# Altium schematic sheet Power_Supply.SchDoc: Power_Supply
size A3; Date: 18/06/2014; DrawnBy: J. Gabriel R.E.; Organization: Seven Solutions S.L.; Address1: C/Baza, Parcela 19, Nave 3; Address2: Polнgono Ind. Juncaril; Address3: 18210-Peligros-Granada; Address4: Spain; Revision: 3.4; SheetNumber: 2; SheetTotal: 23; WebAddress: www.sevensols.com; Project: White Rabbit; ProjectName: Project Name
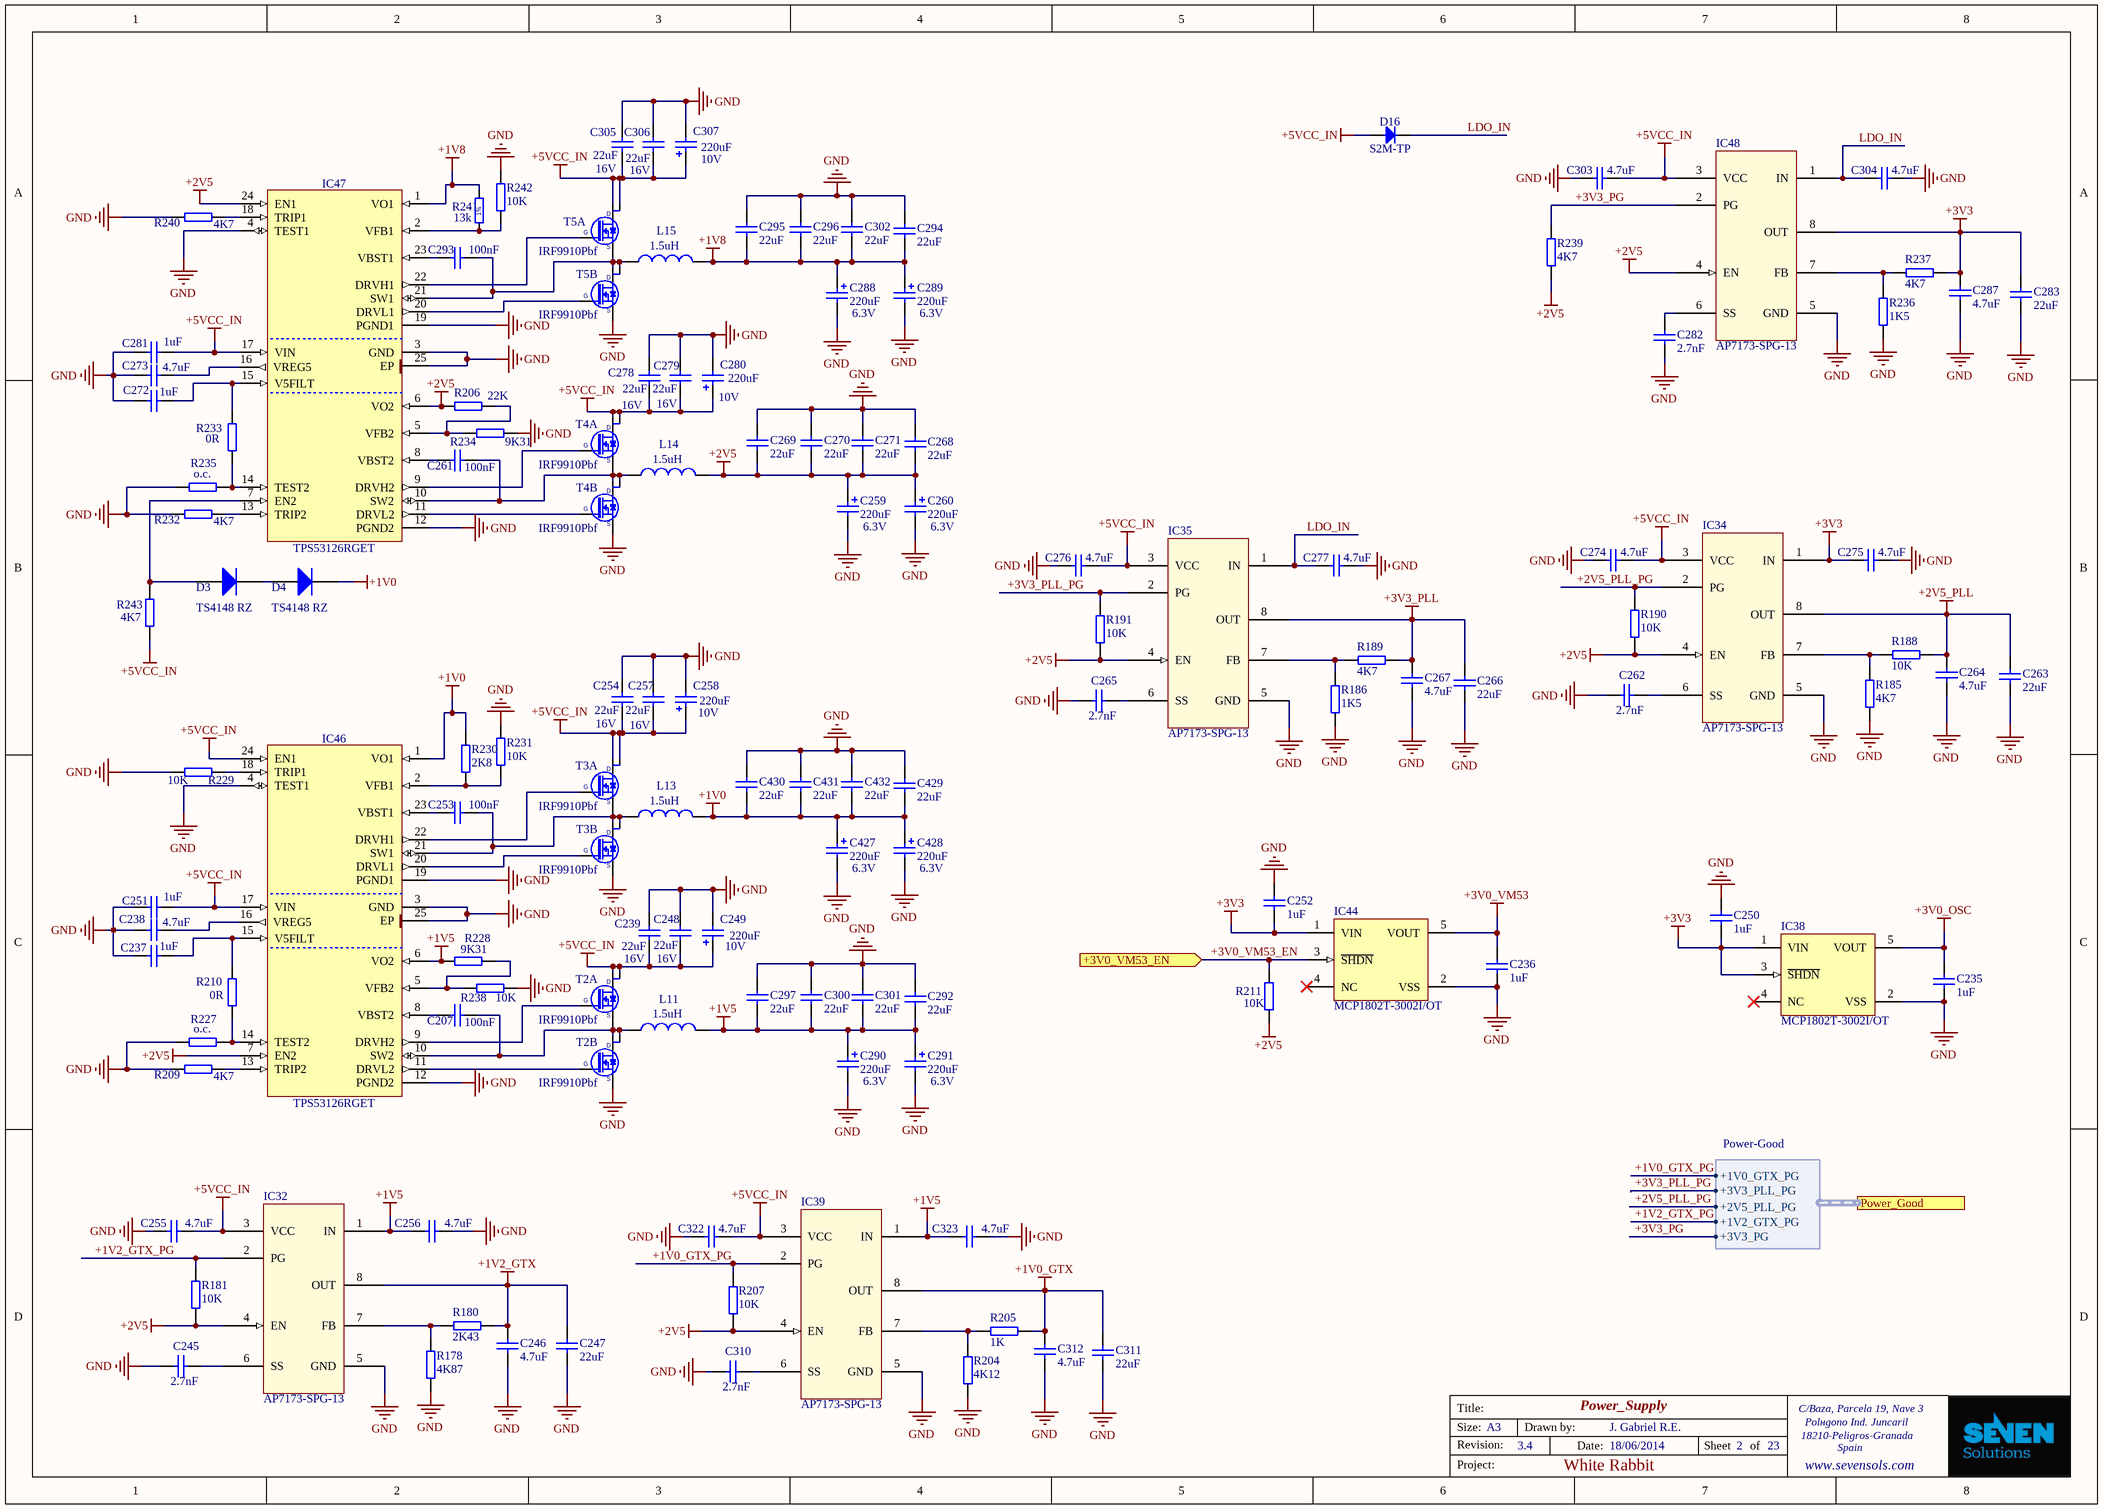
[diagram p0: Power_Supply.SchDoc]

## Parts
C207  100nF  [CC1005-0402]
C235  1uF  [CC1005-0402]
C236  1uF  [CC1005-0402]
C237  1uF  [CC1005-0402]
C238  4.7uF  [CC1608-0603]
C239  value 22uF  Voltage: 16V  [CC2012-0805]  (hidden comment: 22uF 16V)
C245  2.7nF  [CC1005-0402]
C246  4.7uF  [CC1608-0603]
C247  22uF  [CC2012-0805]
C248  value 22uF  Voltage: 16V  [CC2012-0805]  (hidden comment: 22uF 16V)
C249  value 220uF  Voltage: 10V  [D]  (hidden comment: 220uF 10V)
C250  1uF  [CC1005-0402]
C251  1uF  [CC1005-0402]
C252  1uF  [CC1005-0402]
C253  100nF  [CC1005-0402]
C254  value 22uF  Voltage: 16V  [CC2012-0805]  (hidden comment: 22uF 16V)
C255  4.7uF  [CC1608-0603]
C256  4.7uF  [CC1608-0603]
C257  value 22uF  Voltage: 16V  [CC2012-0805]  (hidden comment: 22uF 16V)
C258  value 220uF  Voltage: 10V  [D]  (hidden comment: 220uF 10V)
C259  Voltage: 6.3V  [D]  (hidden comment: 220uF)
C260  Voltage: 6.3V  [D]  (hidden comment: 220uF)
C261  100nF  [CC1005-0402]
C262  2.7nF  [CC1005-0402]
C263  22uF  [CC2012-0805]
C264  4.7uF  [CC1608-0603]
C265  2.7nF  [CC1005-0402]
C266  22uF  [CC2012-0805]
C267  4.7uF  [CC1608-0603]
C268  22uF  [CC2012-0805]
C269  22uF  [CC2012-0805]
C270  22uF  [CC2012-0805]
C271  22uF  [CC2012-0805]
C272  1uF  [CC1005-0402]
C273  4.7uF  [CC1608-0603]
C274  4.7uF  [CC1608-0603]
C275  4.7uF  [CC1608-0603]
C276  4.7uF  [CC1608-0603]
C277  4.7uF  [CC1608-0603]
C278  value 22uF  Voltage: 16V  [CC2012-0805]  (hidden comment: 22uF 16V)
C279  value 22uF  Voltage: 16V  [CC2012-0805]  (hidden comment: 22uF 16V)
C280  value 220uF  Voltage: 10V  [D]  (hidden comment: 220uF 10V)
C281  1uF  [CC1005-0402]
C282  2.7nF  [CC1005-0402]
C283  22uF  [CC2012-0805]
C287  4.7uF  [CC1608-0603]
C288  Voltage: 6.3V  [D]  (hidden comment: 220uF)
C289  Voltage: 6.3V  [D]  (hidden comment: 220uF)
C290  Voltage: 6.3V  [D]  (hidden comment: 220uF)
C291  Voltage: 6.3V  [D]  (hidden comment: 220uF)
C292  22uF  [CC2012-0805]
C293  100nF  [CC1005-0402]
C294  22uF  [CC2012-0805]
C295  22uF  [CC2012-0805]
C296  22uF  [CC2012-0805]
C297  22uF  [CC2012-0805]
C300  22uF  [CC2012-0805]
C301  22uF  [CC2012-0805]
C302  22uF  [CC2012-0805]
C303  4.7uF  [CC1608-0603]
C304  4.7uF  [CC1608-0603]
C305  value 22uF  Voltage: 16V  [CC2012-0805]  (hidden comment: 22uF 16V)
C306  value 22uF  Voltage: 16V  [CC2012-0805]  (hidden comment: 22uF 16V)
C307  value 220uF  Voltage: 10V  [D]  (hidden comment: 220uF 10V)
C310  2.7nF  [CC1005-0402]
C311  22uF  [CC2012-0805]
C312  4.7uF  [CC1608-0603]
C322  4.7uF  [CC1608-0603]
C323  4.7uF  [CC1608-0603]
C427  Voltage: 6.3V  [D]  (hidden comment: 220uF)
C428  Voltage: 6.3V  [D]  (hidden comment: 220uF)
C429  22uF  [CC2012-0805]
C430  22uF  [CC2012-0805]
C431  22uF  [CC2012-0805]
C432  22uF  [CC2012-0805]
D3  TS4148 RZ  [CD1608-0603]
D4  TS4148 RZ  [CD1608-0603]
D16  S2M-TP  [DO-214AA/SMB-MCC]
IC32  AP7173-SPG-13  [SOIC127P600-8AL-ThermalPad]
IC34  AP7173-SPG-13  [SOIC127P600-8AL-ThermalPad]
IC35  AP7173-SPG-13  [SOIC127P600-8AL-ThermalPad]
IC38  MCP1802T-3002I/OT  [SOT-23-OT5_N]
IC39  AP7173-SPG-13  [SOIC127P600-8AL-ThermalPad]
IC44  MCP1802T-3002I/OT  [SOT-23-OT5_N]
IC46  TPS53126RGET  [QFN50P400X400X100-25N-S255]
IC47  TPS53126RGET  [QFN50P400X400X100-25N-S255]
IC48  AP7173-SPG-13  [SOIC127P600-8AL-ThermalPad]
L11  value 1.5uH  [IHLP2525]  (hidden comment: IHLP2525CZER1R5M01)
L13  value 1.5uH  [IHLP2525]  (hidden comment: IHLP2525CZER1R5M01)
L14  value 1.5uH  [IHLP2525]  (hidden comment: IHLP2525CZER1R5M01)
L15  value 1.5uH  [IHLP2525]  (hidden comment: IHLP2525CZER1R5M01)
R178  4K87  [0402]
R180  2K43  [0402]
R181  10k  [0402]
R185  4K7  [0402]
R186  1K5  [0402]
R188  10K  [0402]
R189  4K7  [0402]
R190  10k  [0402]
R191  10k  [0402]
R204  4K12  [0402]
R205  1K  [0402]
R206  22K  [0402]
R207  10K  [0402]
R209  4K7  [0402]
R210  value 0R  [0402]  (hidden comment: Jumper)
R211  10k  [0402]
R227  o.c.  [0402]
R228  9K31  [0402]
R229  10K  [0402]
R230  2K8  [0402]
R231  10K  [0402]
R232  4K7  [0402]
R233  value 0R  [0402]  (hidden comment: Jumper)
R234  9K31  [0402]
R235  o.c.  [0402]
R236  1K5  [0402]
R237  4K7  [0402]
R238  10K  [0402]
R239  4K7  [0402]
R240  4K7  [0402]
R241  13k  [RESC1005X40N]
R242  10K  [0402]
R243  4K7  [0402]
T2  IRF9910Pbf  [SOIC127P600X175-8N]  (parts A,B of 2)
T3  IRF9910Pbf  [SOIC127P600X175-8N]  (parts A,B of 2)
T4  IRF9910Pbf  [SOIC127P600X175-8N]  (parts A,B of 2)
T5  IRF9910Pbf  [SOIC127P600X175-8N]  (parts A,B of 2)

## Ports
+3V0_VM53_EN (in), Power_Good (harness Power-Good)

## Harnesses
Power-Good: +1V2_GTX_PG, +2V5_PLL_PG, +3V3_PLL_PG, +1V0_GTX_PG, +3V3_PG

## Nets
+1V0: C427.1 C428.1 C429.1 C430.2 C431.1 C432.1 D4.2(K) IC46.1(VO1) L13.2 R230.2
+1V0_GTX: C311.2 C312.2 IC39.8(OUT) R205.2
+1V2_GTX: C246.2 C247.2 IC32.8(OUT) R180.2
+1V5: C256.1 C290.1 C291.1 C292.1 C297.2 C300.1 C301.1 C323.1 IC32.1(IN) IC39.1(IN) IC46.6(VO2) L11.2 R228.1
+1V8: C288.1 C289.1 C294.1 C295.2 C296.1 C302.1 IC47.1(VO1) L15.2 R241.2
+2V5: C259.1 C260.1 C268.1 C269.2 C270.1 C271.1 IC32.4(EN) IC34.4(EN) IC35.4(EN) IC39.4(EN) IC46.7(EN2) IC47.6(VO2) IC47.24(EN1) IC48.4(EN) L14.2 R181.1 R190.1 R191.1 R206.2 R207.1 R211.2 R239.1
+2V5_PLL: C263.2 C264.2 IC34.8(OUT) R188.1
+3V0_OSC: C235.2 IC38.5(VOUT)
+3V0_VM53: C236.2 IC44.5(VOUT)
+3V3: C250.2 C252.2 C275.1 C283.2 C287.2 IC34.1(IN) IC38.1(VIN) IC38.3(~{SHDN}) IC44.1(VIN) IC48.8(OUT) R237.2
+3V3_PLL: C266.2 C267.2 IC35.8(OUT) R189.1
+5VCC_IN: C239.1 C248.1 C249.1 C251.2 C254.1 C255.2 C257.1 C258.1 C274.2 C276.2 C278.1 C279.1 C280.1 C281.2 C303.2 C305.1 C306.1 C307.1 C322.2 D16.2(A) IC32.3(VCC) IC34.3(VCC) IC35.3(VCC) IC39.3(VCC) IC46.17(VIN) IC46.24(EN1) IC47.17(VIN) IC48.3(VCC) R243.2 T2.5(D) T2.6(D) T3.5(D) T3.6(D) T4.5(D) T4.6(D) T5.5(D) T5.6(D)
GND: C235.1 C236.1 C237.1 C238.2 C239.2 C245.1 C246.1 C247.1 C248.2 C249.2 C250.1 C251.1 C252.1 C254.2 C255.1 C256.2 C257.2 C258.2 C259.2 C260.2 C262.1 C263.1 C264.1 C265.1 C266.1 C267.1 C268.2 C269.1 C270.2 C271.2 C272.1 C273.2 C274.1 C275.2 C276.1 C277.2 C278.2 C279.2 C280.2 C281.1 C282.1 C283.1 C287.1 C288.2 C289.2 C290.2 C291.2 C292.2 C294.2 C295.1 C296.2 C297.1 C300.2 C301.2 C302.2 C303.1 C304.2 C305.2 C306.2 C307.2 C310.1 C311.1 C312.1 C322.1 C323.2 C427.2 C428.2 C429.2 C430.1 C431.2 C432.2 IC32.5(GND) IC34.5(GND) IC35.5(GND) IC38.2(VSS) IC39.5(GND) IC44.2(VSS) IC46.3(GND) IC46.4(TEST1) IC46.12(PGND2) IC46.19(PGND1) IC46.25(EP) IC47.3(GND) IC47.4(TEST1) IC47.12(PGND2) IC47.19(PGND1) IC47.25(EP) IC48.5(GND) R178.1 R185.1 R186.1 R204.1 R209.2 R227.1 R229.2 R231.2 R232.2 R234.2 R235.1 R236.1 R238.2 R240.2 R242.2 T2.1(S) T3.1(S) T4.1(S) T5.1(S)
+1V0_GTX_PG: IC39.2(PG) R207.2 ; port Power_Good.+1V0_GTX_PG
+1V2_GTX_PG: IC32.2(PG) R181.2 ; port Power_Good.+1V2_GTX_PG
+2V5_PLL_PG: IC34.2(PG) R190.2 ; port Power_Good.+2V5_PLL_PG
+3V0_VM53_EN: IC44.3(~{SHDN}) R211.1 ; port +3V0_VM53_EN
+3V3_PG: IC48.2(PG) R239.2 ; port Power_Good.+3V3_PG
+3V3_PLL_PG: IC35.2(PG) R191.2 ; port Power_Good.+3V3_PLL_PG
LDO_IN: C277.1 C304.1 D16.1(C) IC35.1(IN) IC48.1(IN)
NetC207_1: C207.1 IC46.8(VBST2)
NetC207_2: C207.2 IC46.10(SW2) L11.1 T2.3(S) T2.7(D) T2.8(D)
NetC237_2: C237.2 IC46.15(V5FILT) R210.1
NetC238_1: C238.1 IC46.16(VREG5)
NetC245_2: C245.2 IC32.6(SS)
NetC253_1: C253.1 IC46.23(VBST1)
NetC253_2: C253.2 IC46.21(SW1) L13.1 T3.3(S) T3.7(D) T3.8(D)
NetC261_1: C261.1 IC47.8(VBST2)
NetC261_2: C261.2 IC47.10(SW2) L14.1 T4.3(S) T4.7(D) T4.8(D)
NetC262_2: C262.2 IC34.6(SS)
NetC265_2: C265.2 IC35.6(SS)
NetC272_2: C272.2 IC47.15(V5FILT) R233.1
NetC273_1: C273.1 IC47.16(VREG5)
NetC282_2: C282.2 IC48.6(SS)
NetC293_1: C293.1 IC47.23(VBST1)
NetC293_2: C293.2 IC47.21(SW1) L15.1 T5.3(S) T5.7(D) T5.8(D)
NetC310_2: C310.2 IC39.6(SS)
NetD3_1: D3.1(A) IC47.7(EN2) R243.1
NetD3_2: D3.2(K) D4.1(A)
NetIC32_7: IC32.7(FB) R178.2 R180.1
NetIC34_7: IC34.7(FB) R185.2 R188.2
NetIC35_7: IC35.7(FB) R186.2 R189.2
NetIC39_7: IC39.7(FB) R204.2 R205.1
NetIC46_2: IC46.2(VFB1) R230.1 R231.1
NetIC46_5: IC46.5(VFB2) R228.2 R238.1
NetIC46_9: IC46.9(DRVH2) T2.4(G)
NetIC46_11: IC46.11(DRVL2) T2.2(G)
NetIC46_13: IC46.13(TRIP2) R209.1
NetIC46_14: IC46.14(TEST2) R210.2 R227.2
NetIC46_18: IC46.18(TRIP1) R229.1
NetIC46_20: IC46.20(DRVL1) T3.2(G)
NetIC46_22: IC46.22(DRVH1) T3.4(G)
NetIC47_2: IC47.2(VFB1) R241.1 R242.1
NetIC47_5: IC47.5(VFB2) R206.1 R234.1
NetIC47_9: IC47.9(DRVH2) T4.4(G)
NetIC47_11: IC47.11(DRVL2) T4.2(G)
NetIC47_13: IC47.13(TRIP2) R232.1
NetIC47_14: IC47.14(TEST2) R233.2 R235.2
NetIC47_18: IC47.18(TRIP1) R240.1
NetIC47_20: IC47.20(DRVL1) T5.2(G)
NetIC47_22: IC47.22(DRVH1) T5.4(G)
NetIC48_7: IC48.7(FB) R236.2 R237.1

Not connected (* = marked no-connect by the designer): IC38 4(NC)*; IC44 4(NC)*

## Notes on the sheet
- Title:
- Size:
- Revision:
- A3
- Drawn by:
- Date:
- Sheet
- of
- Project:
- (in symbol R0402_13K_1%_0.0625W_100PPM) 1%

## Library data of the parts
C207 C253 C261 C293 = CC0402_100NF_16V_10%_X7R: Capacitor; Manufacturer1: TDK; Manufacturer1 PN: C1005X7R1C104K; TC: X7R; Tolerance: ±10%; Voltage: 16V; Published: 8-Jun-2000; LatestRevisionDate: 17-Jul-2002; LatestRevisionNote: Re-released for DXP Platform.; PackageReference: RAD-0.3; Publisher: Altium Limited; Distributor1: Digikey; Distributor1 PN: 445-4952-1-ND; Case: 0402; Value: 100nF
C235-C237 C250-C252 C272 C281 = CC0402_1UF_16V_10%_X5R: Capacitor; Manufacturer1: TDK; Manufacturer1 PN: C1005X5R1C105K; TC: X5R; Tolerance: ±10%; Voltage: 16V; Published: 8-Jun-2000; LatestRevisionDate: 17-Jul-2002; LatestRevisionNote: Re-released for DXP Platform.; PackageReference: RAD-0.3; Publisher: Altium Limited; Distributor1: Digikey; Distributor1 PN: 445-4978-1-ND; Case: 0402; Value: 1uF
C238 C246 C255 C256 C264 C267 C273-C277 C287 C303 C304 C312 C322 C323 = CC0603_4.7UF_10V_10%_X5R: Capacitor; Manufacturer1: TDK; Manufacturer1 PN: C1608X5R1A475K; TC: X5R; Tolerance: ±10%; Voltage: 10V; Published: 8-Jun-2000; LatestRevisionDate: 17-Jul-2002; LatestRevisionNote: Re-released for DXP Platform.; PackageReference: RAD-0.3; Publisher: Altium Limited; Distributor1: Digikey; Distributor1 PN: 445-5170-1-ND; Case: 0603; Value: 4.7uF
C239 C248 C254 C257 C278 C279 C305 C306 = CC0805_22UF_16V_10%_X5R: Capacitor; Manufacturer1: Phycomp; Manufacturer1 PN: C2012X5R1C226K; TC: X7R; Tolerance: ±10%; Published: 8-Jun-2000; LatestRevisionDate: 17-Jul-2002; LatestRevisionNote: Re-released for DXP Platform.; PackageReference: RAD-0.3; Publisher: Altium Limited; Distributor1: Digikey; Distributor1 PN: 445-6797-1-ND; Case: 0805
C245 C262 C265 C282 C310 = CC0402_2.7NF_50V_10%_X7R: Capacitor; Manufacturer1: Panasonic; Manufacturer1 PN: ECJ-0EB1H272K; TC: X7R; Tolerance: ±10%; Voltage: 50V; Published: 8-Jun-2000; LatestRevisionDate: 17-Jul-2002; LatestRevisionNote: Re-released for DXP Platform.; PackageReference: RAD-0.3; Publisher: Altium Limited; Distributor1: Digikey; Distributor1 PN: PCC1726CT-ND; Case: 0402; Value: 2.7nF
C247 C263 C266 C268-C271 C283 C292 C294-C297 C300-C302 C311 C429-C432 = CC0805_22UF_6.3V_20%_X5R: Capacitor; Manufacturer1: TDK; Manufacturer1 PN: C2012X5R0J226M; TC: X5R; Tolerance: ±20%; Voltage: 6.3V; Published: 8-Jun-2000; LatestRevisionDate: 17-Jul-2002; LatestRevisionNote: Re-released for DXP Platform.; PackageReference: RAD-0.3; Publisher: Altium Limited; Distributor1: Digikey; Distributor1 PN: 445-1422-1-ND; Case: 0805; Value: 22uF
C249 C258 C280 C307 = CP2917_220UF_10V_20%_TANT: Polarized Capacitor Tantalum; Manufacturer1: Kemet; Manufacturer1 PN: T520D227M010ATE018; Tolerance: ±20%; ESR: 18mOhm; Published: 8-Jun-2000; LatestRevisionDate: 17-Jul-2002; LatestRevisionNote: Re-released for DXP Platform.; PackageReference: RB7.6-15; Publisher: Altium Limited; Case: 2917; Distributor1: Digikey; Distributor1 PN: 399-4045-1-ND; TC: Tantalum
C259 C260 C288-C291 C427 C428 = CP2917_220UF_6.3V_20%_TANT: Polarized Capacitor Tantalum; Manufacturer1: Kemet; Manufacturer1 PN: T520D227M006ATE009; Tolerance: ±20%; ESR: 9mOhm; Published: 8-Jun-2000; LatestRevisionDate: 17-Jul-2002; LatestRevisionNote: Re-released for DXP Platform.; PackageReference: RB7.6-15; Publisher: Altium Limited; Case: 2917; Distributor1: Digikey; Distributor1 PN: T520D227M006ATE009; TC: Tantalum; Value: 220uF
D3 D4 = Diode: Default Diode; Published: 8-Jun-2000; LatestRevisionDate: 17-Jul-2002; LatestRevisionNote: Re-released for DXP Platform.; PackageDocument: Sep-1996; PackageReference: SMC; Publisher: Altium Limited; Code_JEDEC: DO-214-AB; Value: TS4148 RZ; Distributor1 PN: 8150192; Distributor1: Farnell
D16 = S2M-TP: 2 A Silicon Rectifier 50 to 1000 Volts; Manufacturer1: Micro Commercial Components; Author: CERN DEM JLC; Manufacturer1 PN: S2M-TP; Distributor1: Digikey; Distributor1 PN: S2M-TPMSCT-ND
IC32 IC34 IC35 IC39 IC48 = AP7173: 1.5A Low Dropout Linera Regulator; Value: AP7173-SPG-13; Distributor1 PN: AP7173-SPG-13DICT-ND; Distributor1: Digikey
IC38 IC44 = MCP1802T-3002I/OT: 300 mA, High PSRR, Low Quiescent Current LDO, 5-Pin SOT-23, Industrial Temperature, Tape and Reel; FirstPublished: 29-Jan-2009; LatestRevisionDate: 02-Dec-2009; LatestRevisionNote: Updated to datasheet revision B, Jan-2009; DatasheetVersion: revB, Jan-2009; PackageVersion: revBB, Aug-2009; PackageReference: SOT-23-OT5; Publisher: Altium Limited; PackageDescription: 5-Lead Plastic Small Outline Transistor (OT) [SOT-23]; Supplier 1: Digi-Key; Supplier Part Number 1: MCP1802T-3002I/OTTR-ND; Supplier 2: Digi-Key; Supplier Part Number 2: MCP1802T-3002I/OTCT-ND; Supplier 3: Digi-Key; Supplier Part Number 3: MCP1802T-3002I/OTDKR-ND; Supplier 4: Farnell; Supplier Part Number 4: 1578373; Supplier 5: Newark; Supplier Part Number 5: 54M4837; Code_IPC: SOT23-5; ComponentLink1Description: Datasheet; ComponentLink1URL: http://ww1.microchip.com/downloads/en/DeviceDoc/22053b.pdf; ComponentLink2Description: Packaging Specification; ComponentLink2URL: http://www.microchip.com/stellent/groups/techpub_sg/documents/packagingspec/en012702.pdf; ComponentLink3Description: Microchip.com Home; ComponentLink3URL: http://www.microchip.com/
IC46 IC47 = TPS53126RGET: Dual Synchronous Step-Down Controller For Low Voltage Power Rails; Manufacturer: TEXAS INSTRUMENTS; Table: Analog & Interface; Part Number: TPS53126RGET; Component Kind: Standard; Component Type: Standard; Device: TPS53126RGET; PackageDescription: QFN,0.50mm pitch,square;6 pin X 6 pin,4.15mm X 4.15mm X 1.00mm H body (w/thermal tab 2.55 X 2.55mm),  IPC Medium Density; Part Description: Dual Synchronous Step-Down Controller For Low Voltage Power Rails; Manufacturer Part Number: TPS53126RGET; Pin Count: 25; Case: QFN24; Mounted: Yes; Socket: No; SMD: Yes; ComponentHeight: 1.0mm; Author: CERN DEM JLC; HelpURL: \\cern.ch\dfs\Applications\Altium\Datasheets\TPS53126RGET.pdf; CreateDate: 2010-08-26; LatestRevisionDate: 2010-08-26
L11 L13-L15 = Inductor: Low Profile, High Current Inductor; Manufacturer: Vishay/Dale; Published: 8-Jun-2000; Revision: July-2002: Re-released for DXP Platform.; Publisher: Altium Limited; Manufacturer PN: IHLP2525CZER1R5M01; Distributor1 PN: 541-1007-1-ND; Distributor1: Digikey
R178 = R0402_4K87_±1%_0.1W_100PPM: SMD Resistor; Manufacturer1: Panasonic; Manufacturer1 PN: ERJ-2RKF4871X; TCR: 100ppm; Power Rating: 0.1W; Tolerance: ±1%; Case: 0402; Distributor1: DigiKey; Distributor1 PN: P4.87KLCT-ND; Value: 4K87
R180 = R0402_2K43_±1%_0.1W_100PPM: SMD Resistor; Manufacturer1: Panasonic; Manufacturer1 PN: ERJ-2RKF2431X; TCR: 100ppm; Power Rating: 0.1W; Tolerance: ±1%; Case: 0402; Distributor1: DigiKey; Distributor1 PN: P2.43KLCT-ND; Value: 2K43
R181 R188 R190 R191 R207 R211 R229 R231 R238 R242 = R0402_10K_±1%_0.1W_100PPM: SMD Resistor; Manufacturer1: Panasonic; Manufacturer1 PN: ERJ-2RKF1002X; TCR: 100ppm; Power Rating: 0.1W; Tolerance: ±1%; Case: 0402; Distributor1: DigiKey; Distributor1 PN: P10.0KLCT-ND; Value: 10K
R185 R189 R209 R232 R237 R239 R240 R243 = R0402_4.7K_±1%_0.1W_100PPM: SMD Resistor; Manufacturer1: Panasonic; Manufacturer1 PN: ERJ-2RKF4701X; TCR: 100ppm; Power Rating: 0.1W; Tolerance: ±1%; Case: 0402; Distributor1: DigiKey; Distributor1 PN: ERJ-2RKF4701X; Value: 4K7
R186 R236 = R0402_1K5_±1%_0.1W_100PPM: SMD Resistor; Manufacturer1: Panasonic; Manufacturer1 PN: ERJ-2RKF1501X; TCR: 100ppm; Power Rating: 0.1W; Tolerance: ±1%; Case: 0402; Distributor1: DigiKey; Distributor1 PN: P1.50KLCT-ND; Value: 1K5
R204 = R0402_4K12_±1%_0.1W_100PPM: SMD Resistor; Manufacturer1: Panasonic; Manufacturer1 PN: ERJ-2RKF4121X; TCR: 100ppm; Power Rating: 0.1W; Tolerance: ±1%; Case: 0402; Distributor1: DigiKey; Distributor1 PN: P4.12KLCT-ND; Value: 4K12
R205 = R0402_1K_±1%_0.1W_100PPM: SMD Resistor; Manufacturer1: Panasonic; Manufacturer1 PN: ERJ-2RKF1001X; TCR: 100ppm; Power Rating: 0.1W; Tolerance: ±1%; Case: 0402; Distributor1: DigiKey; Distributor1 PN: P1.00KLCT-ND; Value: 1K
R206 = R0402_22K_±1%_0.1W_100PPM: SMD Resistor; Manufacturer1: Panasonic; Manufacturer1 PN: ERJ-2RKF2202X; TCR: 100ppm; Power Rating: 0.1W; Tolerance: ±1%; Case: 0402; Distributor1: DigiKey; Distributor1 PN: P22.0KLCT-ND; Value: 22K
R210 R233 = R0402_0R_0.1W_JUMPER: SMD Resistor; Manufacturer1: Panasonic; Manufacturer1 PN: ERJ-2GE0R00X; TCR: 100ppm; Power Rating: 0.1W; Case: 0402; Distributor1: DigiKey; Distributor1 PN: P0.0JCT-ND; Tolerance: Jumper
R227 R235 = R0402_O.C.: SMD Resistor; Mounted: No; Case: 0402; Manufacturer1: N/A; Manufacturer1 PN: N/A; Distributor1: N/A; Distributor1 PN: N/A; TCR: N/A; Power Rating: N/A; Tolerance: N/A; Value: o.c.
R228 R234 = R0402_9K31_±1%_0.1W_100PPM: SMD Resistor; Manufacturer1: Panasonic; Manufacturer1 PN: ERJ-2RKF9311X; TCR: 100ppm; Power Rating: 0.1W; Tolerance: ±1%; Case: 0402; Distributor1: DigiKey; Distributor1 PN: P9.31KLCT-ND; Value: 9K31
R230 = R0402_2K8_±1%_0.1W_100PPM: SMD Resistor; Manufacturer1: Panasonic; Manufacturer1 PN: ERJ-2RKF2801X; TCR: 100ppm; Power Rating: 0.1W; Tolerance: ±1%; Case: 0402; Distributor1: DigiKey; Distributor1 PN: P2.80KLCT-ND; Value: 2K8
R241 = R0402_13K_1%_0.0625W_100PPM: Resistor - 1%; Part Description: General Purpose Thick Film Chip Resistor; Manufacturer: GENERIC; Manufacturer1 Part Number: 232270671303; TC: ±100ppm/°C; Table: Resistors SMD; Part Number: R0402_13K_1%_0.0625W_100PPM; Component Kind: Standard; Component Type: Standard; Pin Count: 2; Value: 13k; Status: Not recommended; Power: 0.0625W; Tolerance: ±1%; Manufacturer Part Number: R0402_13K_1%_0.0625W_100PPM; Case: 0402; Mounted: Yes; Socket: No; SMD: Yes; Manufacturer1 Example: PHYCOMP; Manufacturer1 ComponentHeight: 0.4mm; HelpURL: \\cern.ch\dfs\Applications\Altium\Datasheets\R0402_Phycomp_RC0402.pdf; Author: CERN DEM JLC; CreateDate: 03/12/2007; LatestRevisionDate: 13/03/2008
T2-T5 = IRF9910Pbf: Dual SO-8 MOSFET For POL Cconverter; Part Description: 20V 10A(Q1) 20V 12A (Q2) Dual SO-8 MOSFET For POL Cconverter; Manufacturer: INTERNATIONAL RECTIFIER; Table: Transistors; Part Number: IRF9910Pbf; Component Kind: Standard; Component Type: Standard; Device: IRF9910Pbf; PackageDescription: SOIC 8, Pitch 1.27mm - Body 4x5mm, IPC Medium Density; Manufacturer Part Number: IRF9910Pbf; Pin Count: 8; Case: DO8; Mounted: Yes; Socket: No; SMD: Yes; ComponentHeight: 1.75mm; HelpURL: \\cern.ch\dfs\Applications\Altium\Datasheets\IRF9910Pbf.pdf; Author: CERN DEM JLC; CreateDate: 30/08/2010; LatestRevisionDate: 30/08/2010